# EAGLE design Ground Plate (EAGLE 9.6.2)
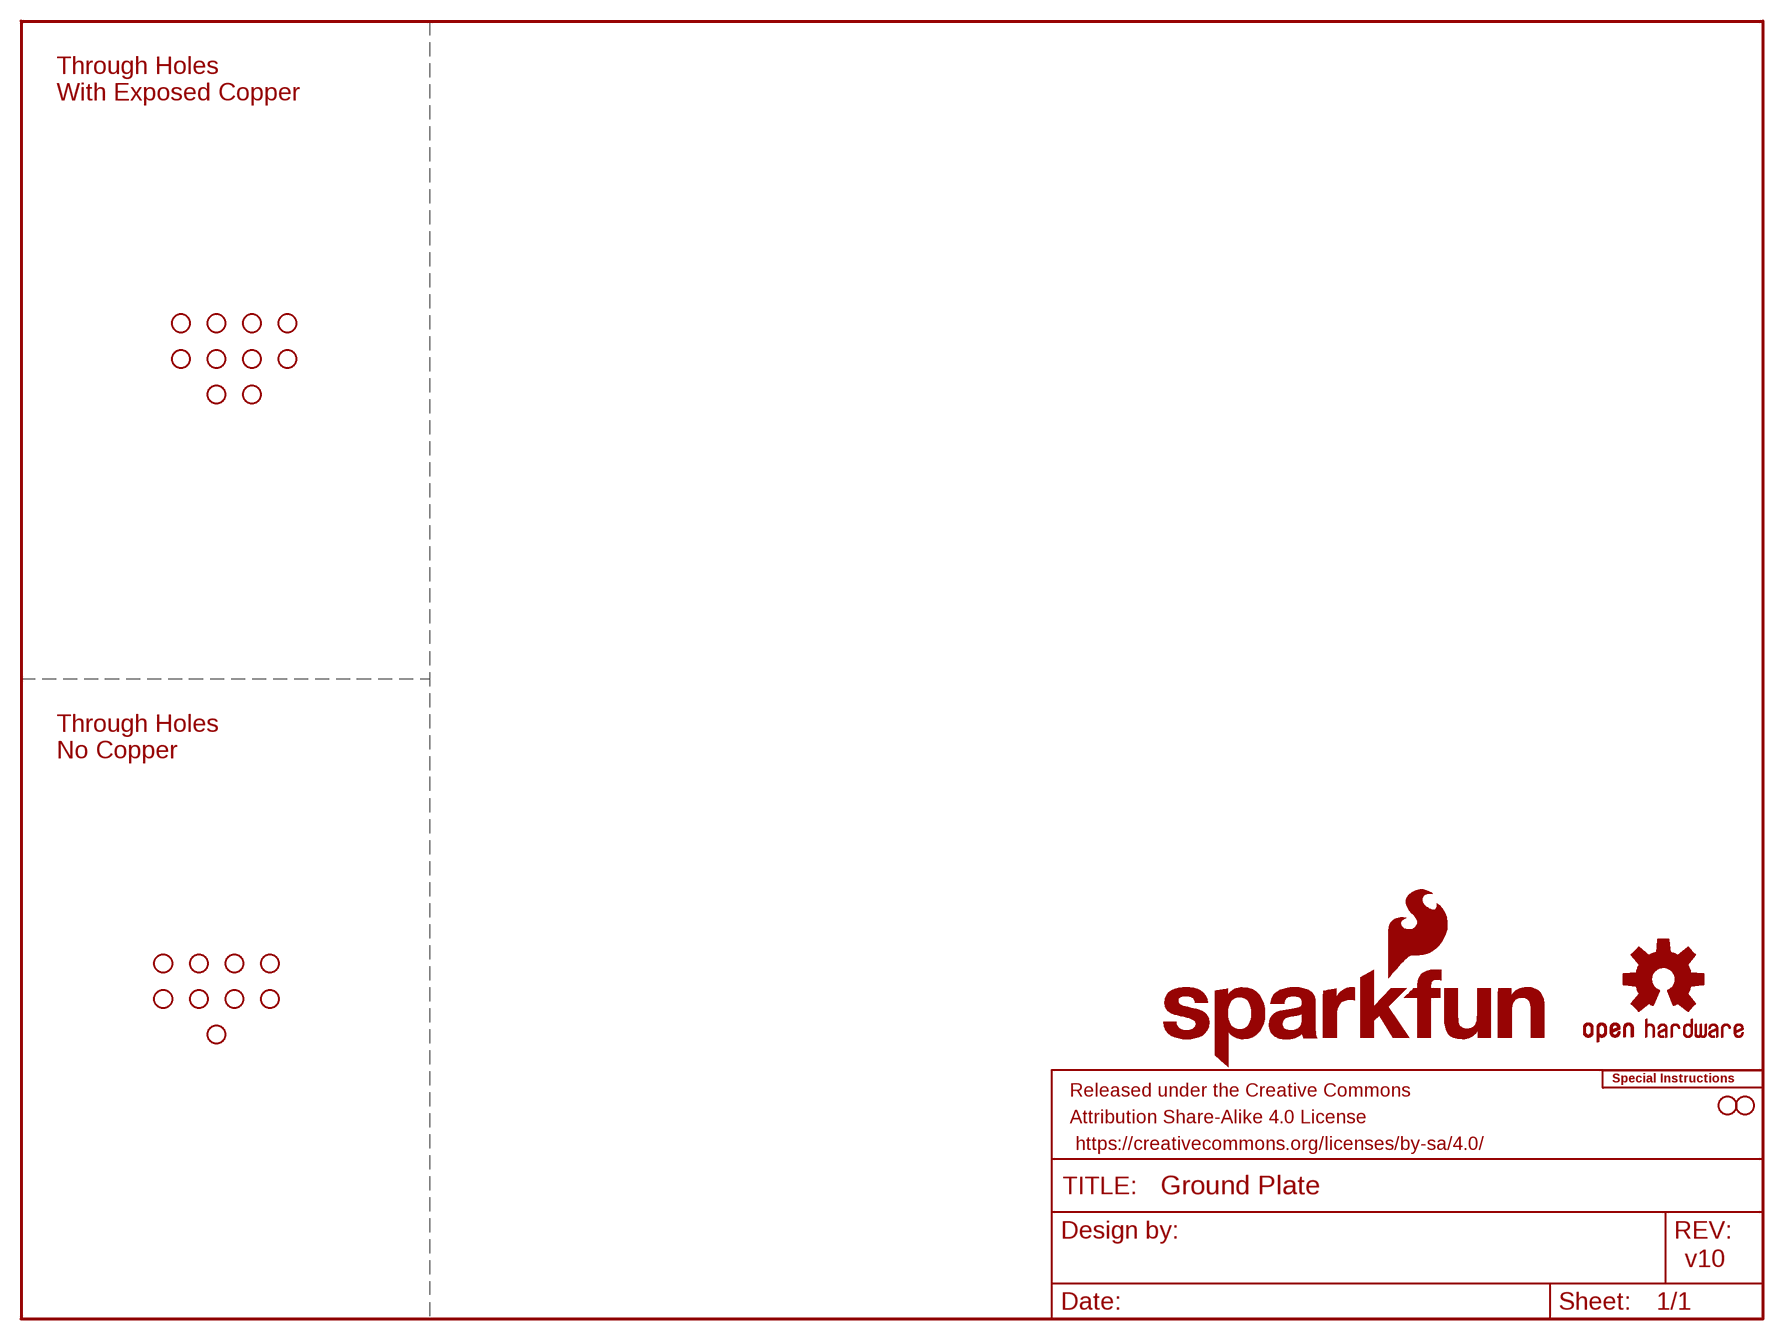
[diagram p0: schematic, sheet 1]

## Parts
FRAME1  FRAME-LETTER  [CREATIVE_COMMONS]
JP31  STAND-OFF  [STAND-OFF]
JP91  STAND-OFF  [STAND-OFF]
LOGO1  OSHW-LOGOM  [OSHW-LOGO-M]
LOGO2  SFE_LOGO_NAME_FLAME.5_INCH  [SFE_LOGO_NAME_FLAME_.5]
U$2  SPECIAL_INSTRUCTIONS-ORDERING  [ORDERING_INSTRUCTIONS]
U$5  SMA-ANTENNA-THREADED-NOT-KEYED_WITH-STOP  [SMA-THREADED_WITH-STOP]
U$6  SMA-ANTENNA-THREADED-NOT-KEYED_WITH-STOP  [SMA-THREADED_WITH-STOP]
U$7  SMA-ANTENNA-THREADED-NOT-KEYED_WITH-STOP  [SMA-THREADED_WITH-STOP]
U$8  SMA-ANTENNA-THREADED-NOT-KEYED_WITH-STOP  [SMA-THREADED_WITH-STOP]
U$9  SMA-ANTENNA-THREADED-NOT-KEYED_WITH-STOP  [SMA-THREADED_WITH-STOP]
U$10  SMA-ANTENNA-THREADED-NOT-KEYED_WITH-STOP  [SMA-THREADED_WITH-STOP]
U$11  SMA-ANTENNA-THREADED-NOT-KEYED_WITH-STOP  [SMA-THREADED_WITH-STOP]
U$12  SMA-ANTENNA-THREADED-NOT-KEYED_WITH-STOP  [SMA-THREADED_WITH-STOP]
U$13  SMA-ANTENNA-THREADED-NOT-KEYED_NO-COPPER  [SMA-THREADED_NO-COPPER]
U$14  SMA-ANTENNA-THREADED-NOT-KEYED_NO-COPPER  [SMA-THREADED_NO-COPPER]
U$15  SMA-ANTENNA-THREADED-NOT-KEYED_NO-COPPER  [SMA-THREADED_NO-COPPER]
U$16  SMA-ANTENNA-THREADED-NOT-KEYED_NO-COPPER  [SMA-THREADED_NO-COPPER]
U$17  SMA-ANTENNA-THREADED-NOT-KEYED_NO-COPPER  [SMA-THREADED_NO-COPPER]
U$18  SMA-ANTENNA-THREADED-NOT-KEYED_NO-COPPER  [SMA-THREADED_NO-COPPER]
U$19  SMA-ANTENNA-THREADED-NOT-KEYED_NO-COPPER  [SMA-THREADED_NO-COPPER]
U$20  SMA-ANTENNA-THREADED-NOT-KEYED_NO-COPPER  [SMA-THREADED_NO-COPPER]
U$21  SMA-ANTENNA-THREADED-NOT-KEYED_NO-COPPER  [SMA-THREADED_NO-COPPER]
U$22  SMA-ANTENNA-THREADED-NOT-KEYED_WITH-STOP  [SMA-THREADED_WITH-STOP]
U$54  SMA-ANTENNA-THREADED-NOT-KEYED_WITH-STOP  [SMA-THREADED_WITH-STOP]

## Notes on the sheet
- Through Holes
  With Exposed Copper
- Through Holes
  No Copper
- v10

## Library data of the parts
FRAME1 = SparkFun-Aesthetics:FRAME-LETTER: Schematic Frame - Letter Standard 8.5x11 US Letter frame
JP31 JP91 = SparkFun:STAND-OFF: Stand Off This is the mechanical footprint for a #4 phillips button head screw. Use the keepout ring to avoid running the screw head into surrounding components. SKU : PRT-00447
LOGO1 = SparkFun-Aesthetics:OSHW-LOGO: Open-Source Hardware (OSHW) Logo This logo indicates the piece of hardware it is found on incorporates a OSHW license and/or adheres to the definition of open source hardware found here: http://freedomdefined.org/OSHW
LOGO2 = SparkFun-Aesthetics:SFE_LOGO_NAME_FLAME: SparkFun Font Logo w/ Flame This is the SparkFun full logo. The logo on the schematic will always be the same size; the package variant is the height of the flame part of the logo. Default layer for the logo on the board is tSilk.
U$2 = SparkFun-Aesthetics:SPECIAL_INSTRUCTIONS: Special Ordering/Production Instructions Alert Symbol for special PCB ordering instructions or unique production process warnings. Ordering Instructions Production Instructions Types of information that should be added to box: Copper weight Soldermask color Silk color PCB thickness Number of layers PCB Standard: 1.6mm FR4 1 oz copper immersion silver plating red soldermask white silkscreen Types of information that should be added to box: Special wash requirements Depaneling instructions Humidification Glue curing Default text settings: 0.07 inch 9% ratio 50% line distance
U$5-U$22 U$54 = SparkFun-Hardware:SMA-ANTENNA-THREADED: This is a milled 'D' shaped hole that permits a standard threaded SMA female connector to be inserted and attached through a PCB.

## Net classes
1 power: width 0.178 mm
2 3.3V: width 0.508 mm

## Board
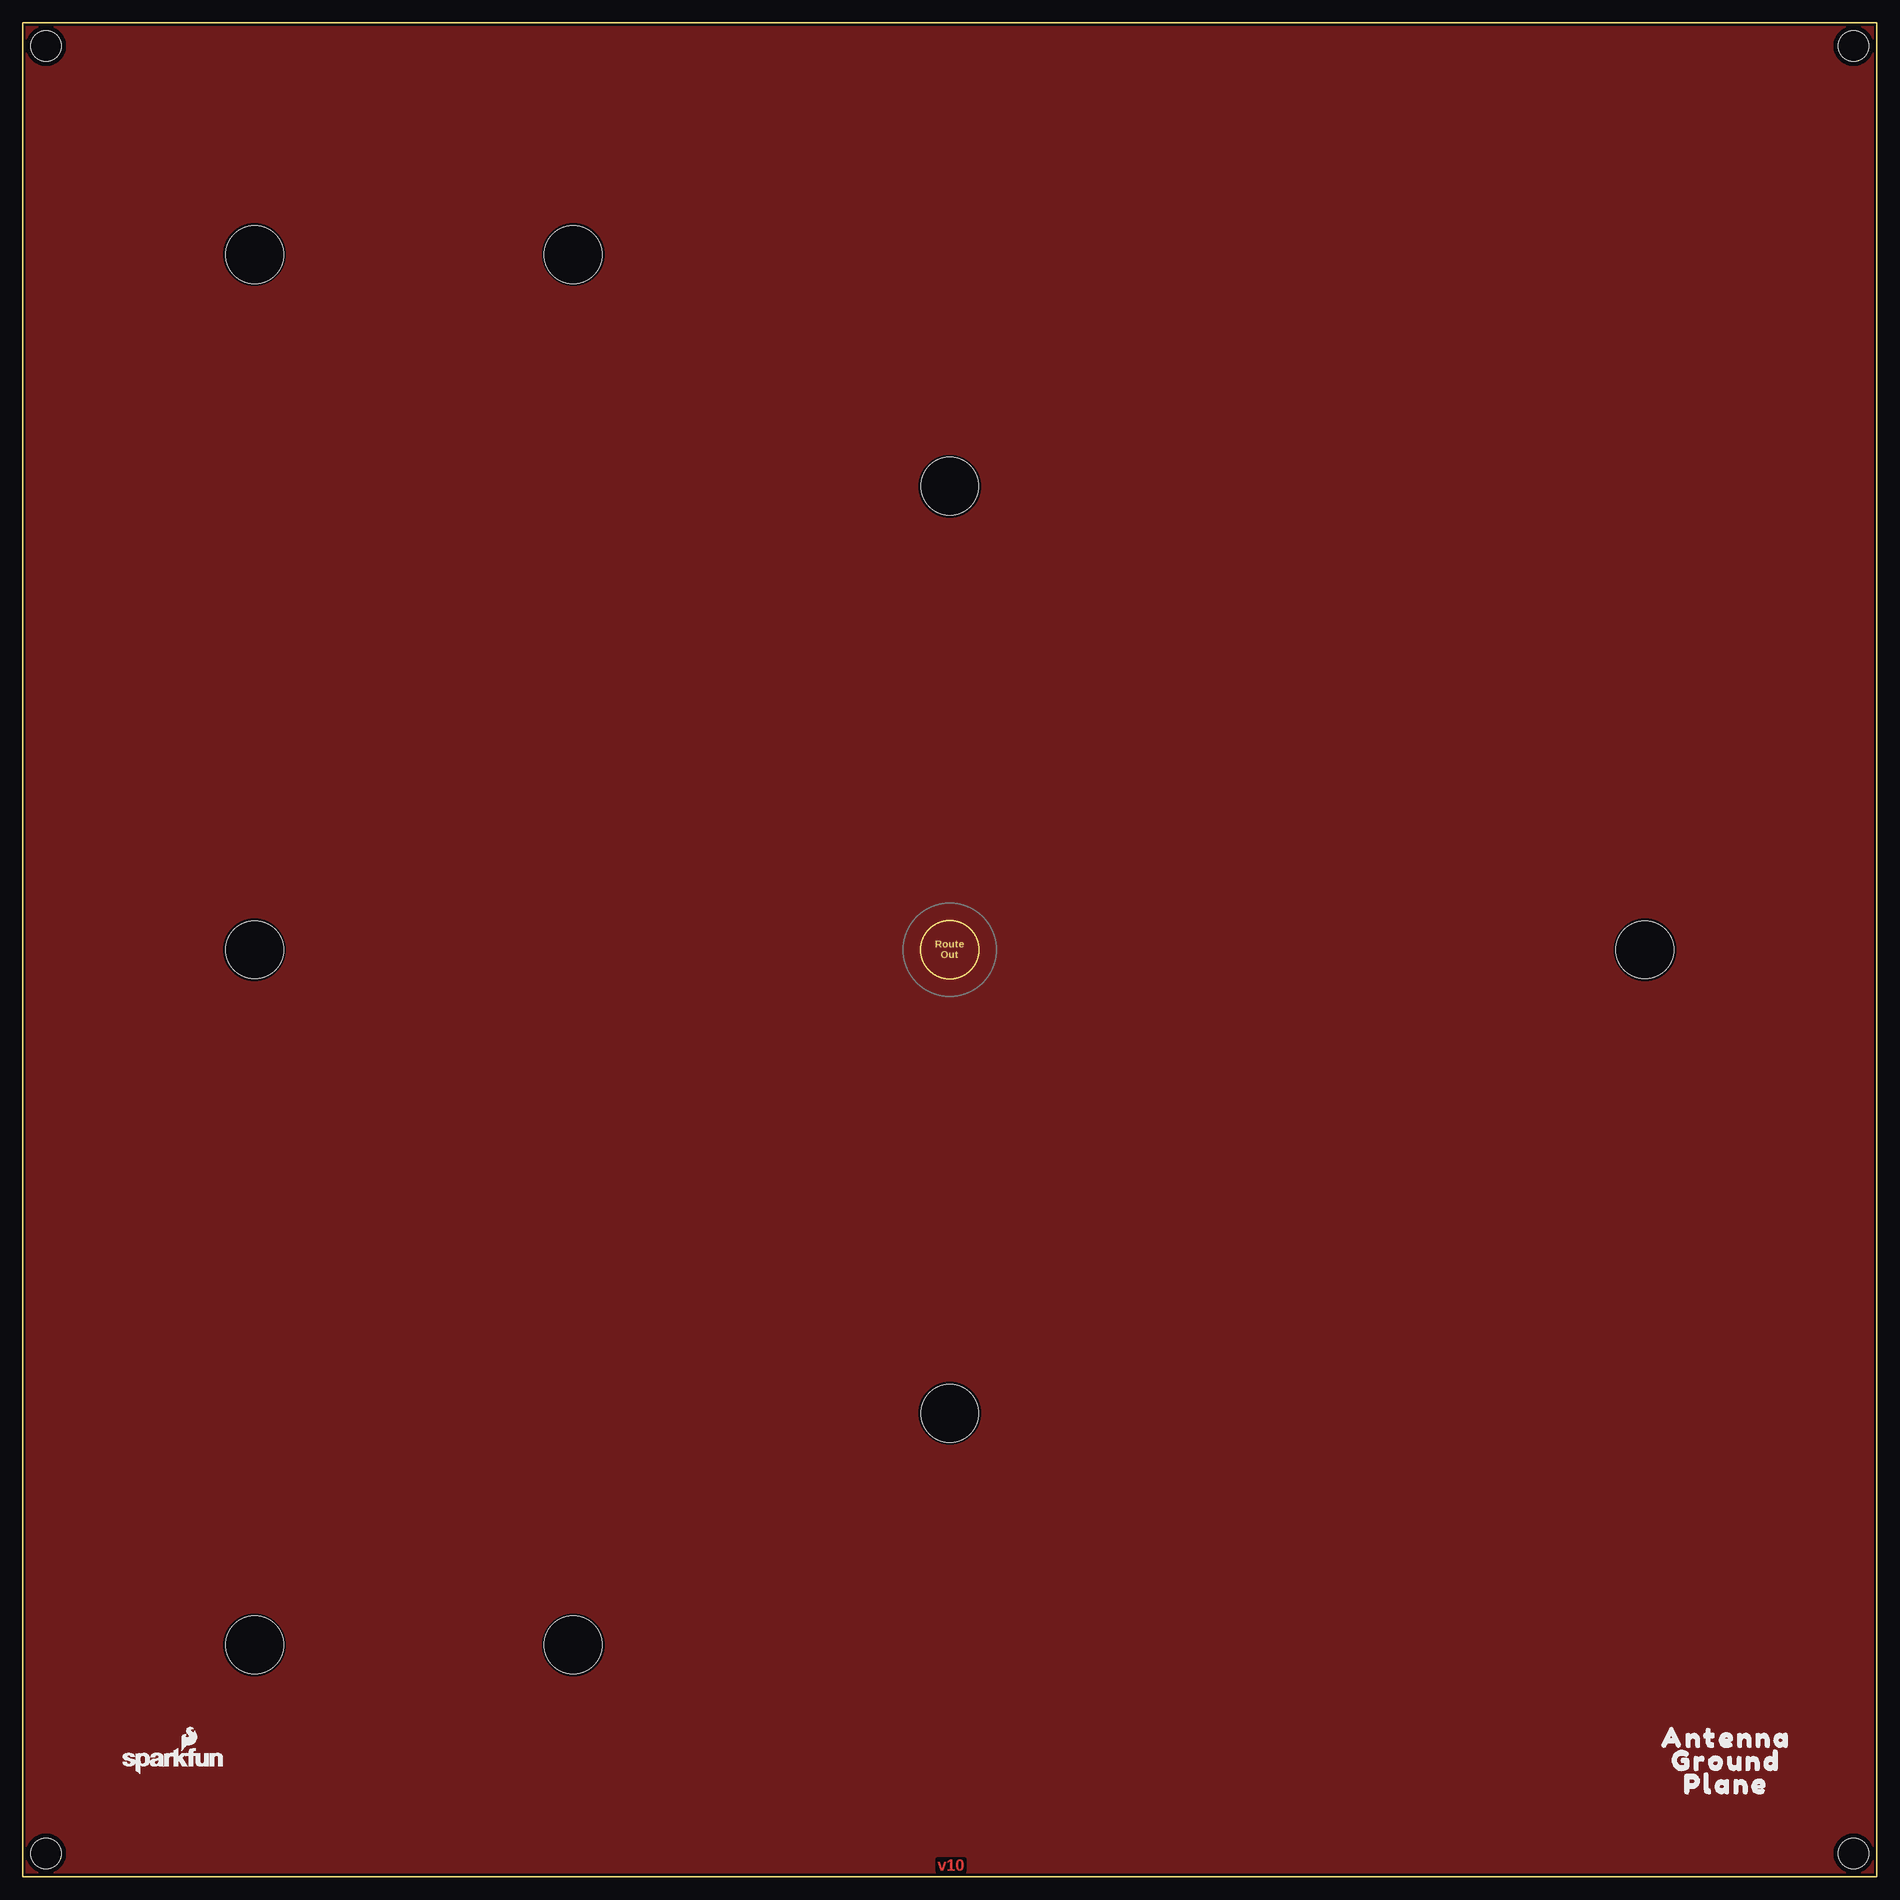
[diagram p1: board, top side]
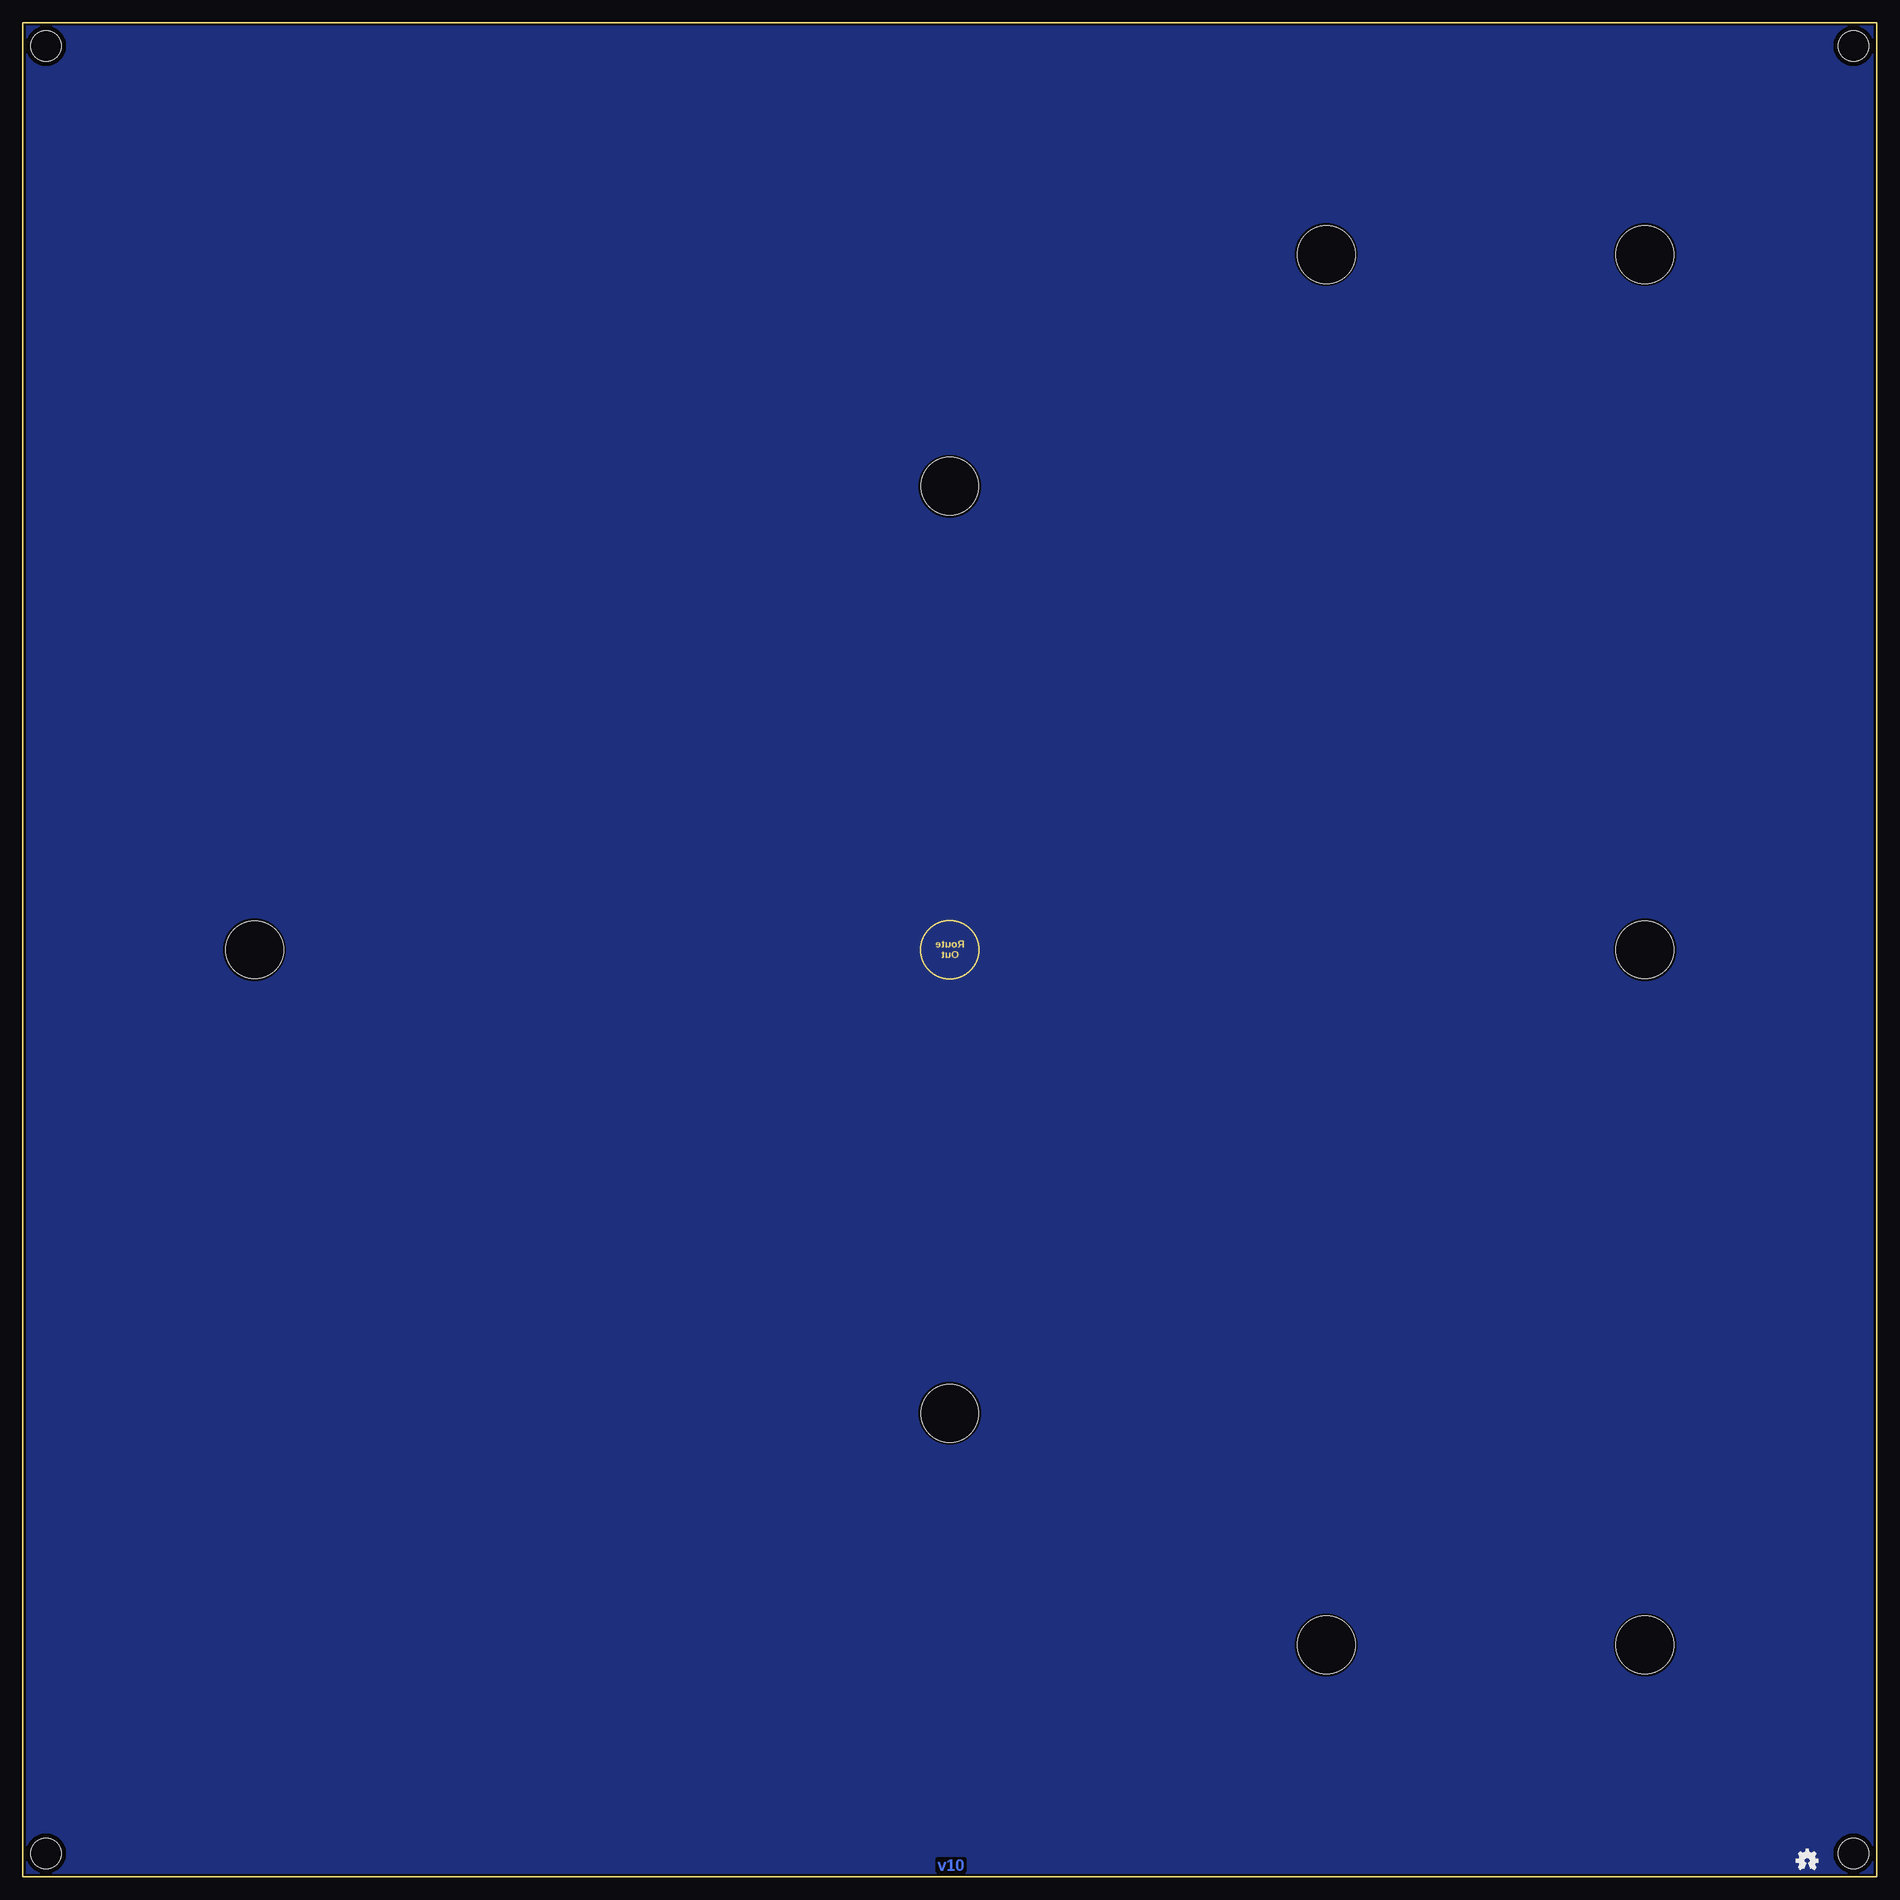
[diagram p2: board, bottom side, seen from below]

Size 203.2 x 203.2 mm. Coordinates in mm from the lower left corner, seen from the top.
Outline: 203.2,0 0,0 0,203.2 203.2,203.2 203.2,0
Copper layers (1*16): Top 0.035mm / dielectric 1.5mm / Bottom 0.035mm
Design rules "SparkFun-2-layer-PCBWay-LIMIT": minimum track width 6mil, minimum drill 0.3mm, track to track 6mil, track to pad 6mil, pad to pad 6mil, via to via 6mil, smd to smd 6mil, copper to edge 6mil, drill to drill 6mil, minimum pad ring 6mil, minimum via ring 6mil, stop-mask expansion 4mil, vias tented up to drill 25mil, thermal gap 10mil
Holes 6.35 mm at 25.4,25.4 60.33,25.4 25.4,177.8 60.33,177.8 25.4,101.6 177.8,101.6 101.6,152.4 101.6,50.8

### Footprints (pad centres in the part's own frame; a part is rotated, then mirrored left to right if it is on the bottom)
STAND-OFF = hole 3.302: 0,0

### Placement (x,y rotation side)
FRAME1  242.57,92.71 0 top  (outside the outline)
JP31  2.54,2.54 90 top
JP41  STAND-OFF  [STAND-OFF]  2.54,200.66 90 top
JP91  200.66,2.54 90 top
JP101  STAND-OFF  [STAND-OFF]  200.66,200.66 90 top
LOGO1  OSHW-LOGOMINI  [OSHW-LOGO-MINI]  7.62,1.78 0 bottom
LOGO2  SFE_LOGO_NAME_FLAME.1_INCH  [SFE_LOGO_NAME_FLAME_.1]  16.51,12.7 0 top
U$1  [ANTENNA0]  186.69,15.24 0 top
U$2  232.41,69.85 0 top  (outside the outline)
U$3  [GROUND1]  186.69,12.7 0 top
U$4  [PLANE2]  186.69,10.16 0 top
U$54  SMA-ANTENNA-THREADED  [SMA-THREADED]  101.6,101.6 0 top

### Tracks (layer width: path | path; a pad name or v marks a point on that pad's centre or on a via)
GND
  pour Top (isolate 0.254, rank 4): 0,0 0,203.2 203.2,203.2 203.2,0
  pour Bottom (isolate 0.254, rank 4): 0,0 0,203.2 203.2,203.2 203.2,0

### Text on the board
Top: v10
Bottom: v10
Measures: Measurements in inches
tDocu: Board thickness is 1.6mm